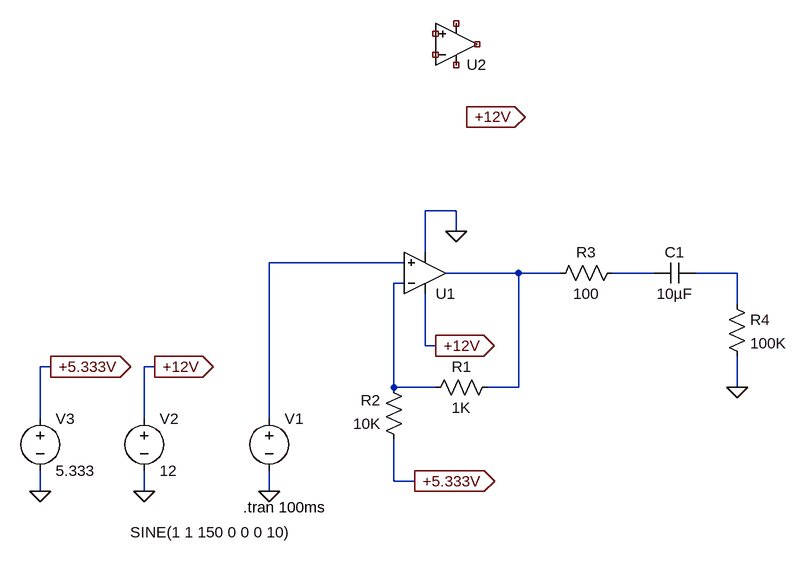
[diagram p0: schematic VCA_Output.asc]
VCA_Output.asc, the LTspice schematic file:
Version 4
SHEET 1 880 680
WIRE 352 -208 304 -208
WIRE 352 -176 352 -208
WIRE 304 -144 304 -208
WIRE 272 -128 64 -128
WIRE 448 -112 336 -112
WIRE 512 -112 448 -112
WIRE 656 -112 592 -112
WIRE 784 -112 720 -112
WIRE 272 -96 256 -96
WIRE 784 -64 784 -112
WIRE 304 0 304 -80
WIRE 320 0 304 0
WIRE -272 32 -288 32
WIRE -112 32 -128 32
WIRE 256 64 256 -96
WIRE 320 64 256 64
WIRE 448 64 448 -112
WIRE 448 64 400 64
WIRE 784 64 784 16
WIRE -288 112 -288 32
WIRE -128 112 -128 32
WIRE 64 112 64 -128
WIRE 256 208 256 144
WIRE 288 208 256 208
WIRE -288 224 -288 192
WIRE -128 224 -128 192
WIRE 64 224 64 192
FLAG 64 224 0
FLAG -128 224 0
FLAG -112 32 +12V
IOPIN -112 32 Out
FLAG 320 0 +12V
IOPIN 320 0 Out
FLAG 352 -176 0
FLAG -272 32 +5.333V
IOPIN -272 32 Out
FLAG -288 224 0
FLAG 288 208 +5.333V
IOPIN 288 208 Out
FLAG 784 64 0
FLAG 368 -352 +12V
IOPIN 368 -352 Out
SYMBOL voltage 64 96 R0
WINDOW 3 -214 191 Left 2
WINDOW 123 0 0 Left 0
WINDOW 39 0 0 Left 0
SYMATTR InstName V1
SYMATTR Value SINE(1 1 150 0 0 0 10)
SYMBOL OpAmps\\UniversalOpAmp1 304 -112 M180
SYMATTR InstName U1
SYMBOL voltage -128 96 R0
WINDOW 123 0 0 Left 0
WINDOW 39 0 0 Left 0
SYMATTR InstName V2
SYMATTR Value 12
SYMBOL res 416 48 R90
WINDOW 0 0 56 VBottom 2
WINDOW 3 32 56 VTop 2
SYMATTR InstName R1
SYMATTR Value 1K
SYMBOL res 272 160 R180
WINDOW 0 36 76 Left 2
WINDOW 3 36 40 Left 2
SYMATTR InstName R2
SYMATTR Value 10K
SYMBOL voltage -288 96 R0
WINDOW 123 0 0 Left 0
WINDOW 39 0 0 Left 0
SYMATTR InstName V3
SYMATTR Value 5.333
SYMBOL res 608 -128 R90
WINDOW 0 0 56 VBottom 2
WINDOW 3 32 56 VTop 2
SYMATTR InstName R3
SYMATTR Value 100
SYMBOL cap 720 -128 R90
WINDOW 0 0 32 VBottom 2
WINDOW 3 32 32 VTop 2
SYMATTR InstName C1
SYMATTR Value 10µF
SYMBOL res 768 -80 R0
SYMATTR InstName R4
SYMATTR Value 100K
SYMBOL OpAmps\\UniversalOpAmp1 352 -464 M180
SYMATTR InstName U2
TEXT 24 248 Left 2 !.tran 100ms

The netlist it stands for:
* VCA_Output.asc
V1 N001 0 SINE(1 1 150 0 0 0 10)
XU1 N001 N005 +12V 0 N002 level1 Avol=1Meg GBW=10Meg Vos=0 En=0 Enk=0 In=0 Ink=0 Rin=500Meg  ; pins In+ In- V+ V- OUT
V2 +12V 0 12
R1 N002 N005 1K
R2 +5.333V N005 10K
V3 +5.333V 0 5.333
R3 N003 N002 100
C1 N004 N003 10µF
R4 N004 0 100K
XU2 NC_01 NC_02 NC_03 NC_04 NC_05 level1 Avol=1Meg GBW=10Meg Vos=0 En=0 Enk=0 In=0 Ink=0 Rin=500Meg  ; pins In+ In- V+ V- OUT
.tran 100ms
.lib UniversalOpAmp1.lib
.backanno
.end